# EAGLE design Lightbox2 (EAGLE 9.2.0)
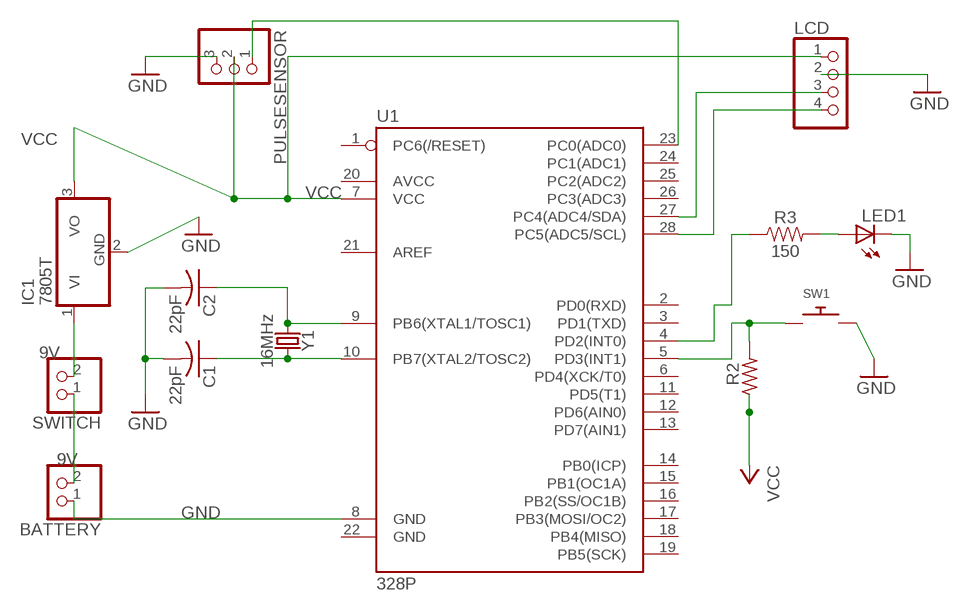
[diagram p0: schematic, sheet 1]

## Parts
BATTERY  PINHD-1X2  [1X02]
C1  22pF  C-US025-024X044  [C025-024X044]
C2  22pF  C-US025-024X044  [C025-024X044]
IC1  7805T  [TO220H]
LCD  PINHD-1X4  [1X04]
LED1  LED5MM  [LED5MM]
PULSESENSOR  PINHD-1X3  [1X03]
R2  R-US_0204/5  [0204/5]
R3  150  150OHM-0603-1/10W-1%  [0603]
SW1  SWITCH_PUSHBUTTONEVQ-PE  [TACT_PANA-EVQ]
SWITCH  PINHD-1X2  [1X02]
U1  328P  ATMEGA328P_PDIP  [DIP28]
Y1  16MHz  CRYSTAL-16MHZPTH-HC49US  [HC49US]

## Nets
9V: BATTERY.2 IC1.1(VI) SWITCH.1 SWITCH.2
GND: BATTERY.1 C1.2 C2.2 IC1.2(GND) LCD.2 LED1.K(C) PULSESENSOR.3 SW1.P$2 U1.8(GND)
N$6: LED1.A R3.2
PC0/ADC0: PULSESENSOR.1 U1.23(PC0(ADC0))
PD2: R3.1 U1.4(PD2(INT0))
PD3: R2.2 SW1.P$1 U1.5(PD3(INT1))
SCL: LCD.4 U1.28(PC5(ADC5/SCL))
SDA: LCD.3 U1.27(PC4(ADC4/SDA))
VCC: IC1.3(VO) LCD.1 PULSESENSOR.2 R2.1 U1.7(VCC)
XTAL1: C2.1 U1.9(PB6(XTAL1/TOSC1)) Y1.1
XTAL2: C1.1 U1.10(PB7(XTAL2/TOSC2)) Y1.2
Unconnected: U1.1(PC6(/RESET)) U1.2(PD0(RXD)) U1.3(PD1(TXD)) U1.6(PD4(XCK/T0)) U1.11(PD5(T1)) U1.12(PD6(AIN0)) U1.13(PD7(AIN1)) U1.14(PB0(ICP)) U1.15(PB1(OC1A)) U1.16(PB2(SS/OC1B)) U1.17(PB3(MOSI/OC2)) U1.18(PB4(MISO)) U1.19(PB5(SCK)) U1.20(AVCC) U1.21(AREF) U1.22(GND) U1.24(PC1(ADC1)) U1.25(PC2(ADC2)) U1.26(PC3(ADC3))

## Library data of the parts
BATTERY SWITCH = pinhead:PINHD-1X2: PIN HEADER
C1 C2 = adafruit:C-US: CAPACITOR, American symbol
IC1 = adafruit:78*: Positive VOLTAGE REGULATOR Added bigger pads to the TO-92 package
LCD = pinhead:PINHD-1X4: PIN HEADER
LED1 = adafruit:LED: LED OSRAM: - CHIPLED LG R971, LG N971, LY N971, LG Q971, LY Q971, LO R971, LY R971 LH N974, LH R974 LS Q976, LO Q976, LY Q976 LO Q996 - Hyper CHIPLED LW Q18S LB Q993, LB Q99A, LB R99A - SideLED LS A670, LO A670, LY A670, LG A670, LP A670 LB A673, LV A673, LT A673, LW A673 LH A674 LY A675 LS A676, LA A676, LO A676, LY A676, LW A676 LS A679, LY A679, LG A679 - Hyper Micro SIDELED® LS Y876, LA Y876, LO Y876, LY Y876 LT Y87S - SmartLED LW L88C, LW L88S LB L89C, LB L89S, LG L890 LS L89K, LO L89K, LY L89K LS L896, LA L896, LO L896, LY L896 - TOPLED LS T670, LO T670, LY T670, LG T670, LP T670 LSG T670, LSP T670, LSY T670, LOP T670, LYG T670 LG T671, LOG T671, LSG T671 LB T673, LV T673, LT T673, LW T673 LH T674 LS T676, LA T676, LO T676, LY T676, LB T676, LH T676, LSB T676, LW T676 LB T67C, LV T67C, LT T67C, LS T67K, LO T67K, LY T67K, LW E67C LS E67B, LA E67B, LO E67B, LY E67B, LB E67C, LV E67C, LT E67C LW T67C LS T679, LY T679, LG T679 LS T770, LO T770, LY T770, LG T770, LP T770 LB T773, LV T773, LT T773, LW T773 LH T774 LS E675, LA E675, LY E675, LS T675 LS T776, LA T776, LO T776, LY T776, LB T776 LHGB T686 LT T68C, LB T68C - Hyper Mini TOPLED® LB M676 - Mini TOPLED Santana® LG M470 LS M47K, LO M47K, LY M47K Source: http://www.osram.convergy.de/
PULSESENSOR = adafruit:PINHD-1X3: PIN HEADER
R2 = adafruit:R-US_: RESISTOR, American symbol
R3 = SparkFun-Resistors:150OHM: 150Ω resistor A resistor is a passive two-terminal electrical component that implements electrical resistance as a circuit element. Resistors act to reduce current flow, and, at the same time, act to lower voltage levels within circuits. - Wikipedia; PROD_ID: RES-11028
SW1 = adafruit:SWITCH_PUSHBUTTON: Buttons SOFTTOUCHSMD_SJ - Soft touch temporary push button (Super Junk Akihabara) Compatible with SKPMANE010 [Mouser: 688-SKPMAN] C&K_KSS = Digikey: KSS221GLFS
U1 = SparkFun-IC-Microcontroller:ATMEGA328P_PDIP: Atmel 328P Through hole ATMEGA328P uC used in the Arduino 32kb flash, 1k EEPROM, 2k SRAM Datasheet <http://www.sparkfun.com/datasheets/Components/SMD/ATMega328.pdf> SparkFun Products Storefront component: AVR 28 Pin 20MHz 32K 6A/D - ATMega328P <https://www.sparkfun.com/products/9061> (COM-09061) SparkFun Simon Says - Through-Hole Soldering Kit <https://www.sparkfun.com/products/10547> (KIT-10547) SparkFun Learn to Solder - Simon Says <https://www.sparkfun.com/products/13708> (KIT-13708) SparkFun BigTime Watch Kit <https://www.sparkfun.com/products/11734> (KIT-11734) SparkFun ClockIt <https://www.sparkfun.com/products/10930> (KIT-10930) SparkFun Serial Enabled LCD Kit <https://www.sparkfun.com/products/10097> (LCD-10097) SparkFun Simon Tilts - Through Hole Soldering Kit <https://www.sparkfun.com/products/12634> (KIT-12634) SparkFun Frequency Counter Kit <https://www.sparkfun.com/products/10140> (KIT-10140) FabFM Radio Kit <https://www.sparkfun.com/products/11043> (KIT-11043) SparkFun Binary Blaster Kit <https://www.sparkfun.com/products/12037> (KIT-12037) SparkFun Metro-Gnome <https://www.sparkfun.com/products/9236> (KIT-09236) ATmega328 with Arduino Optiboot (Uno) <https://www.sparkfun.com/products/10524> (DEV-10524); PROD_ID: IC-09136
Y1 = SparkFun-Clocks:CRYSTAL-16MHZ: 16MHz Crystal Digikey Example <http://www.digikey.com/product-search/en?keywords=535-9122-1-ND> Frequency: 16MHz Frequency Stability: ±50ppm Frequency Tolerance: ±20ppm Load Capacitance: 18pF SparkFun Products: Pro Micro -5V/16MHz <https://www.sparkfun.com/products/12640> SparkFun Serial Enabled LCD Kit <https://www.sparkfun.com/products/10097>; PROD_ID: XTAL-08181; SF_ID: COM-00536

## Board
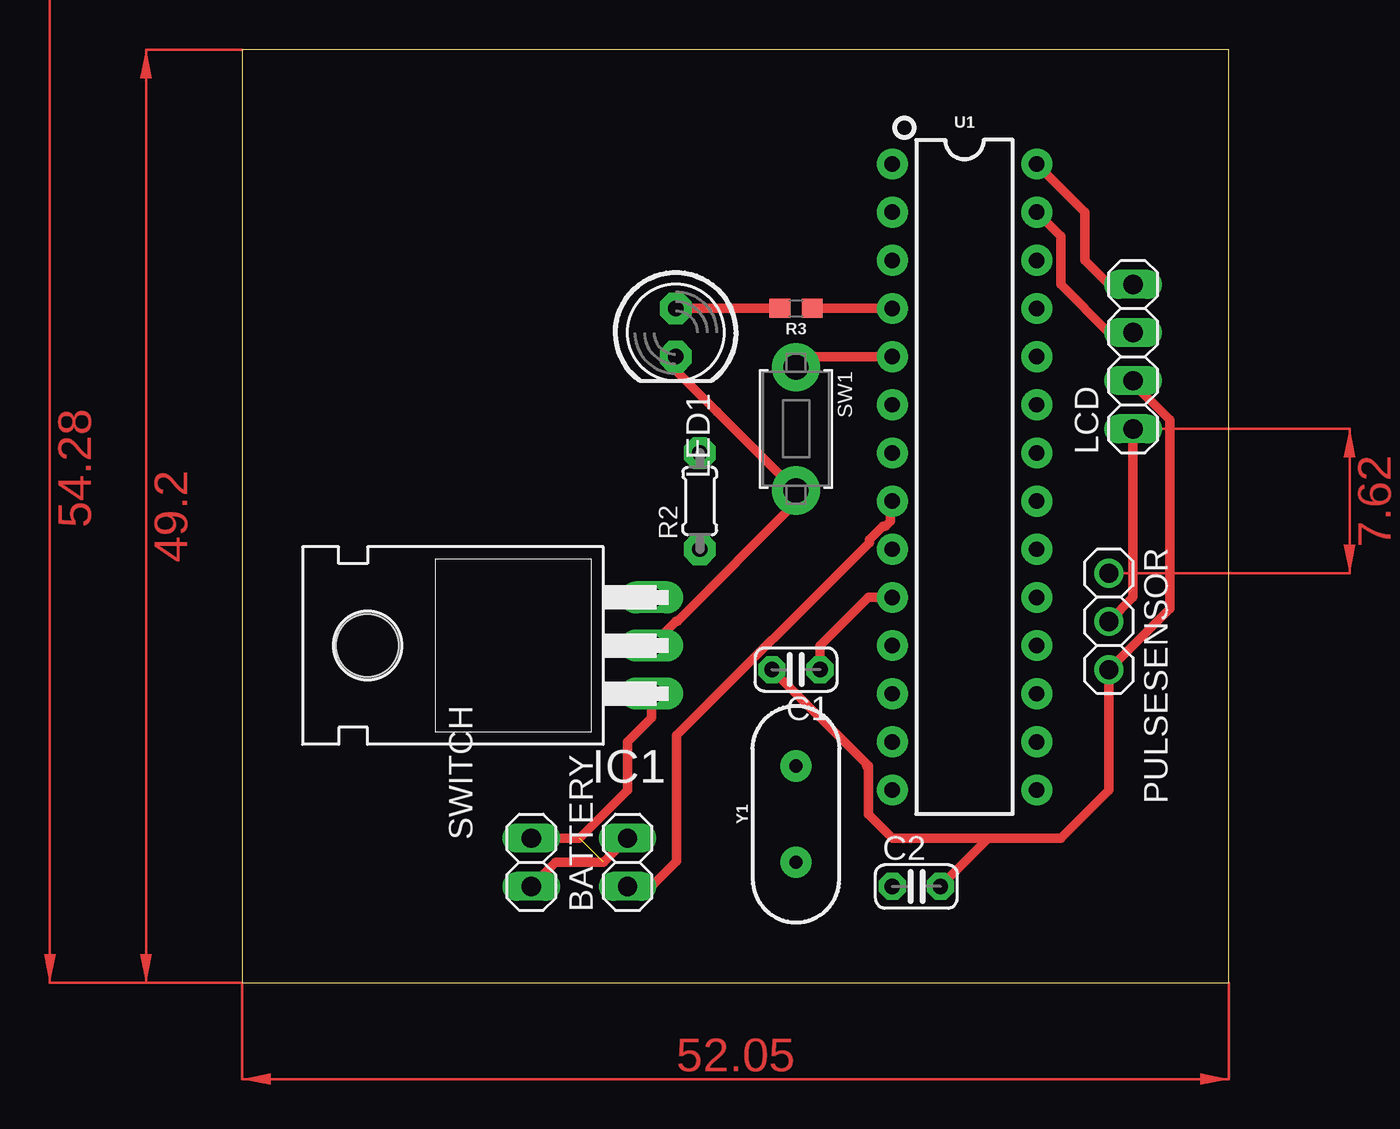
[diagram p1: board, top side]
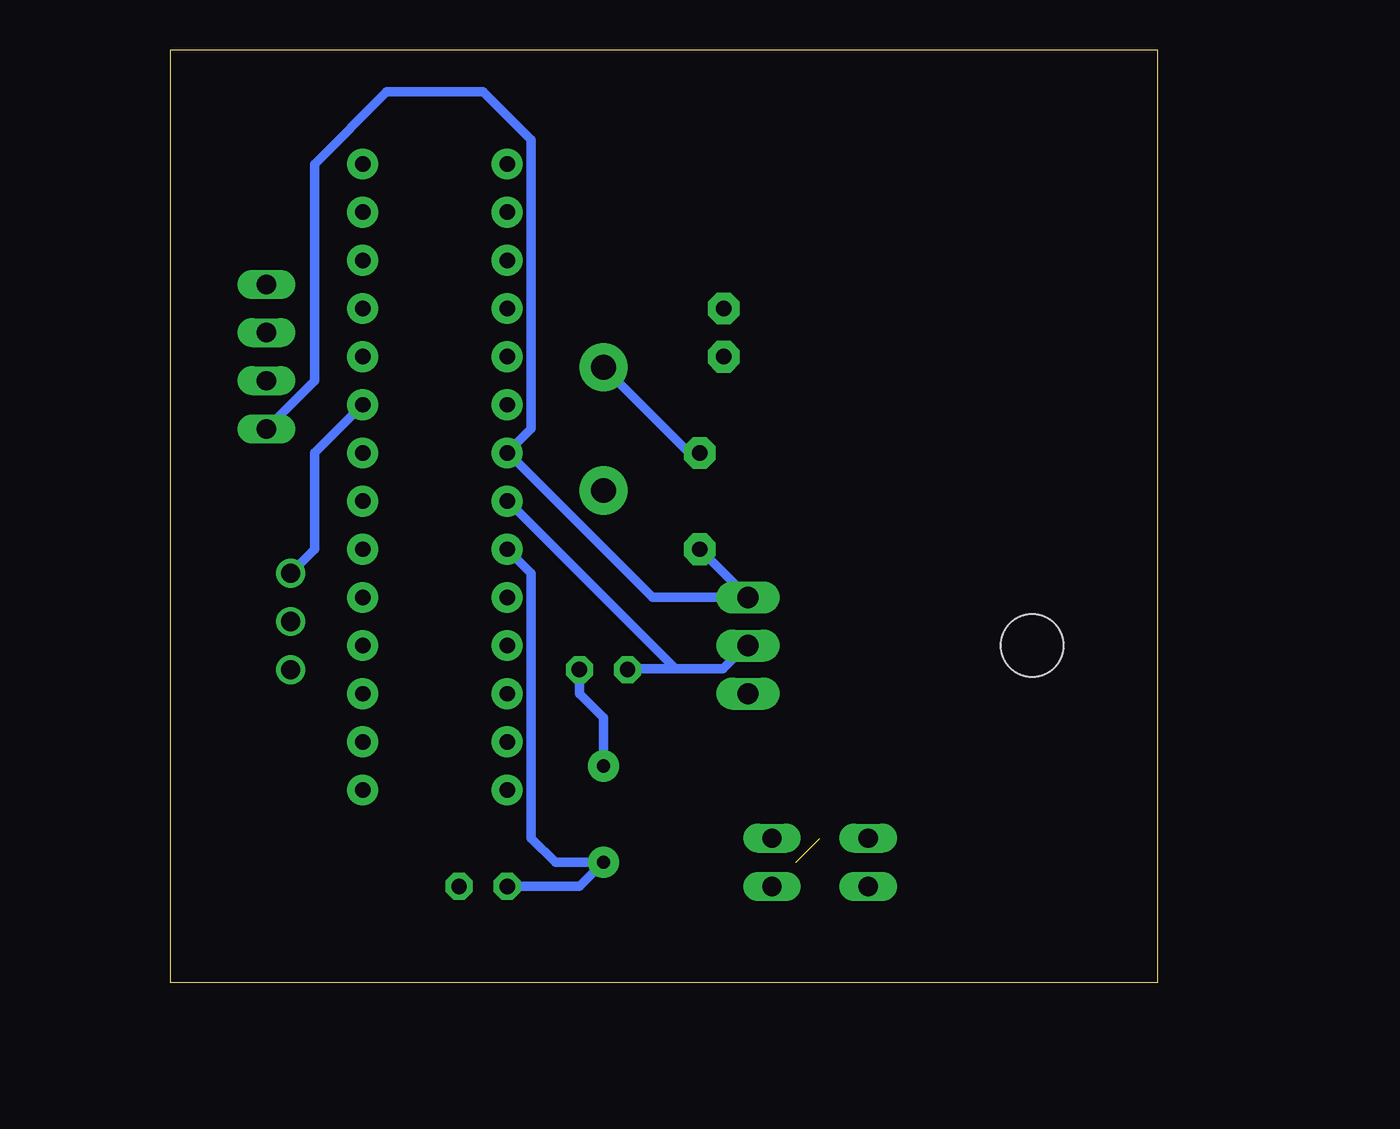
[diagram p2: board, bottom side, seen from below]

Size 52.05 x 49.2 mm. Coordinates in mm from the lower left corner, seen from the top.
Outline: 0,0 52.05,0 52.05,49.2 0,49.2 0,0
Copper layers (1*16): Top 0.035mm / dielectric 1.5mm / Bottom 0.035mm
Design rules "default": minimum track width 6mil, minimum drill 0.35mm, track to track 6mil, track to pad 6mil, pad to pad 6mil, via to via 6mil, smd to smd 6mil, copper to edge 40mil, drill to drill 6mil, minimum pad ring 10mil, minimum via ring 8mil, stop-mask expansion 4mil, vias tented up to drill 0mil, thermal gap 10mil

### Footprints (pad centres in the part's own frame; a part is rotated, then mirrored left to right if it is on the bottom)
1X02 = drill 1.016 long: 1 -1.27,0; 2 1.27,0
C025-024X044 = drill 0.813 pad 1.422 octagon: 1 -1.27,0; 2 1.27,0
TO220H = drill 1.118 long: 1 -2.54,-10.16; 2 0,-10.16; 3 2.54,-10.16 | hole 3.302: 0,4.826
1X04 = drill 1.016 long: 1 -3.81,0; 2 -1.27,0; 3 1.27,0; 4 3.81,0
LED5MM = drill 0.813 pad 1.676 octagon: A -1.27,0; K 1.27,0
1X03 = drill 1.016: 1 -2.54,0; 2 0,0; 3 2.54,0
0204/5 = drill 0.813 pad 1.676 octagon: 1 -2.54,0; 2 2.54,0
0603 = smd 1.1 x 1: 1 -0.85,0; 2 0.85,0
TACT_PANA-EVQ = drill 1.3 pad 2.54: P$1 -3.25,0; P$2 3.25,0
DIP28 = drill 0.813 pad 1.626: 1 -16.51,-3.81; 2 -13.97,-3.81; 3 -11.43,-3.81; 4 -8.89,-3.81; 5 -6.35,-3.81; 6 -3.81,-3.81; 7 -1.27,-3.81; 8 1.27,-3.81; 9 3.81,-3.81; 10 6.35,-3.81; 11 8.89,-3.81; 12 11.43,-3.81; 13 13.97,-3.81; 14 16.51,-3.81; 15 16.51,3.81; 16 13.97,3.81; 17 11.43,3.81; 18 8.89,3.81; 19 6.35,3.81; 20 3.81,3.81; 21 1.27,3.81; 22 -1.27,3.81; 23 -3.81,3.81; 24 -6.35,3.81; 25 -8.89,3.81; 26 -11.43,3.81; 27 -13.97,3.81; 28 -16.51,3.81
HC49US = drill 0.7 pad 1.651: 1 -2.54,0; 2 2.54,0

### Placement (x,y rotation side)
BATTERY  20.32,6.35 90 top
C1  29.21,16.51 180 top
C2  35.56,5.08 0 top
IC1  11.43,17.78 90 top
LCD  46.99,33.02 90 top
LED1  22.86,34.29 270 top
PULSESENSOR  45.72,19.05 270 top
R2  24.13,25.4 90 top
R3  29.21,35.56 180 top
SW1  29.21,29.21 270 top
SWITCH  15.24,6.35 90 top
U1  38.1,26.67 270 top
Y1  29.21,8.89 90 top

### Tracks (layer width: path | path; a pad name or v marks a point on that pad's centre or on a via)
9V  (1 unrouted)
  Top 0.508: BATTERY.2 19.05,6.35 16.51,6.35 SWITCH.1 | SWITCH.2 17.78,7.62 20.32,10.16 20.32,12.7 21.59,13.97 IC1.1
GND
  Top 0.152: 25.04,30.12 29.16,26.01 SW1.P$2 | 43.18,7.62 39.37,7.62 34.29,7.62 | 34.19,25.4 U1.8
  Top 0.508: IC1.2 22.89,19.07 22.94,19.07 29.21,25.34 SW1.P$2 | SW1.P$2 | LED1.K 22.86,32.31 25.04,30.12 SW1.P$2 | LCD.2 46.99,31.62 48.92,29.69 48.92,19.71 PULSESENSOR.3 45.72,10.16 43.18,7.62 34.29,7.62 33.02,8.89 33.02,11.43 | 33.02,11.43 32.92,11.43 | 39.37,7.62 C2.2 | 33.02,11.43 C1.2 | 34.19,25.4 34.19,24.33 33.93,24.08 33.78,24.08 33.07,23.36 33.07,23.22 22.91,13.06 22.91,6.4 21.59,5.08 BATTERY.1
  Bottom 0.152: 25.4,16.56 27.94,16.56
  Bottom 0.508: IC1.2 21.69,17.78 22.91,16.56 25.4,16.56 | 25.4,16.56 27.89,16.56 C1.2 | 25.4,16.56 34.24,25.4 U1.8
N$6
  Top 0.508: R3.2 LED1.A
PC0/ADC0
  Bottom 0.508: U1.23 44.45,27.94 44.45,22.86 PULSESENSOR.1
PD2
  Top 0.508: U1.4 R3.1
PD3
  Top 0.508: SW1.P$1 29.77,33.02 U1.5
  Bottom 0.508: R2.2 24.69,27.94 SW1.P$1
SCL
  Top 0.508: U1.28 44.45,40.64 44.45,38.1 45.72,36.83 LCD.4
SDA
  Top 0.508: U1.27 43.18,39.37 43.18,36.83 45.72,34.29 LCD.3
VCC
  Top 0.152: 34.34,27.99 U1.7
  Top 0.508: PULSESENSOR.2 46.99,20.32 LCD.1
  Bottom 0.508: LCD.1 44.45,31.75 44.45,43.18 40.64,46.99 35.56,46.99 33.02,44.45 33.02,29.21 U1.7 34.24,27.94 26.62,20.32 IC1.3 R2.1
XTAL1
  Bottom 0.508: U1.9 33.02,21.59 33.02,7.62 31.75,6.35 Y1.1 30.48,5.08 C2.1
XTAL2
  Top 0.508: C1.1 30.48,17.78 33.02,20.32 U1.10
  Bottom 0.508: Y1.2 29.21,13.97 30.48,15.24 C1.1
(copper drawn outside any net)
  shapes: Top area x4